# Altium schematic sheet schematic.SchDoc: Display & buttons board
size A2; Revision: 1; SheetNumber: 6; SheetTotal: 29
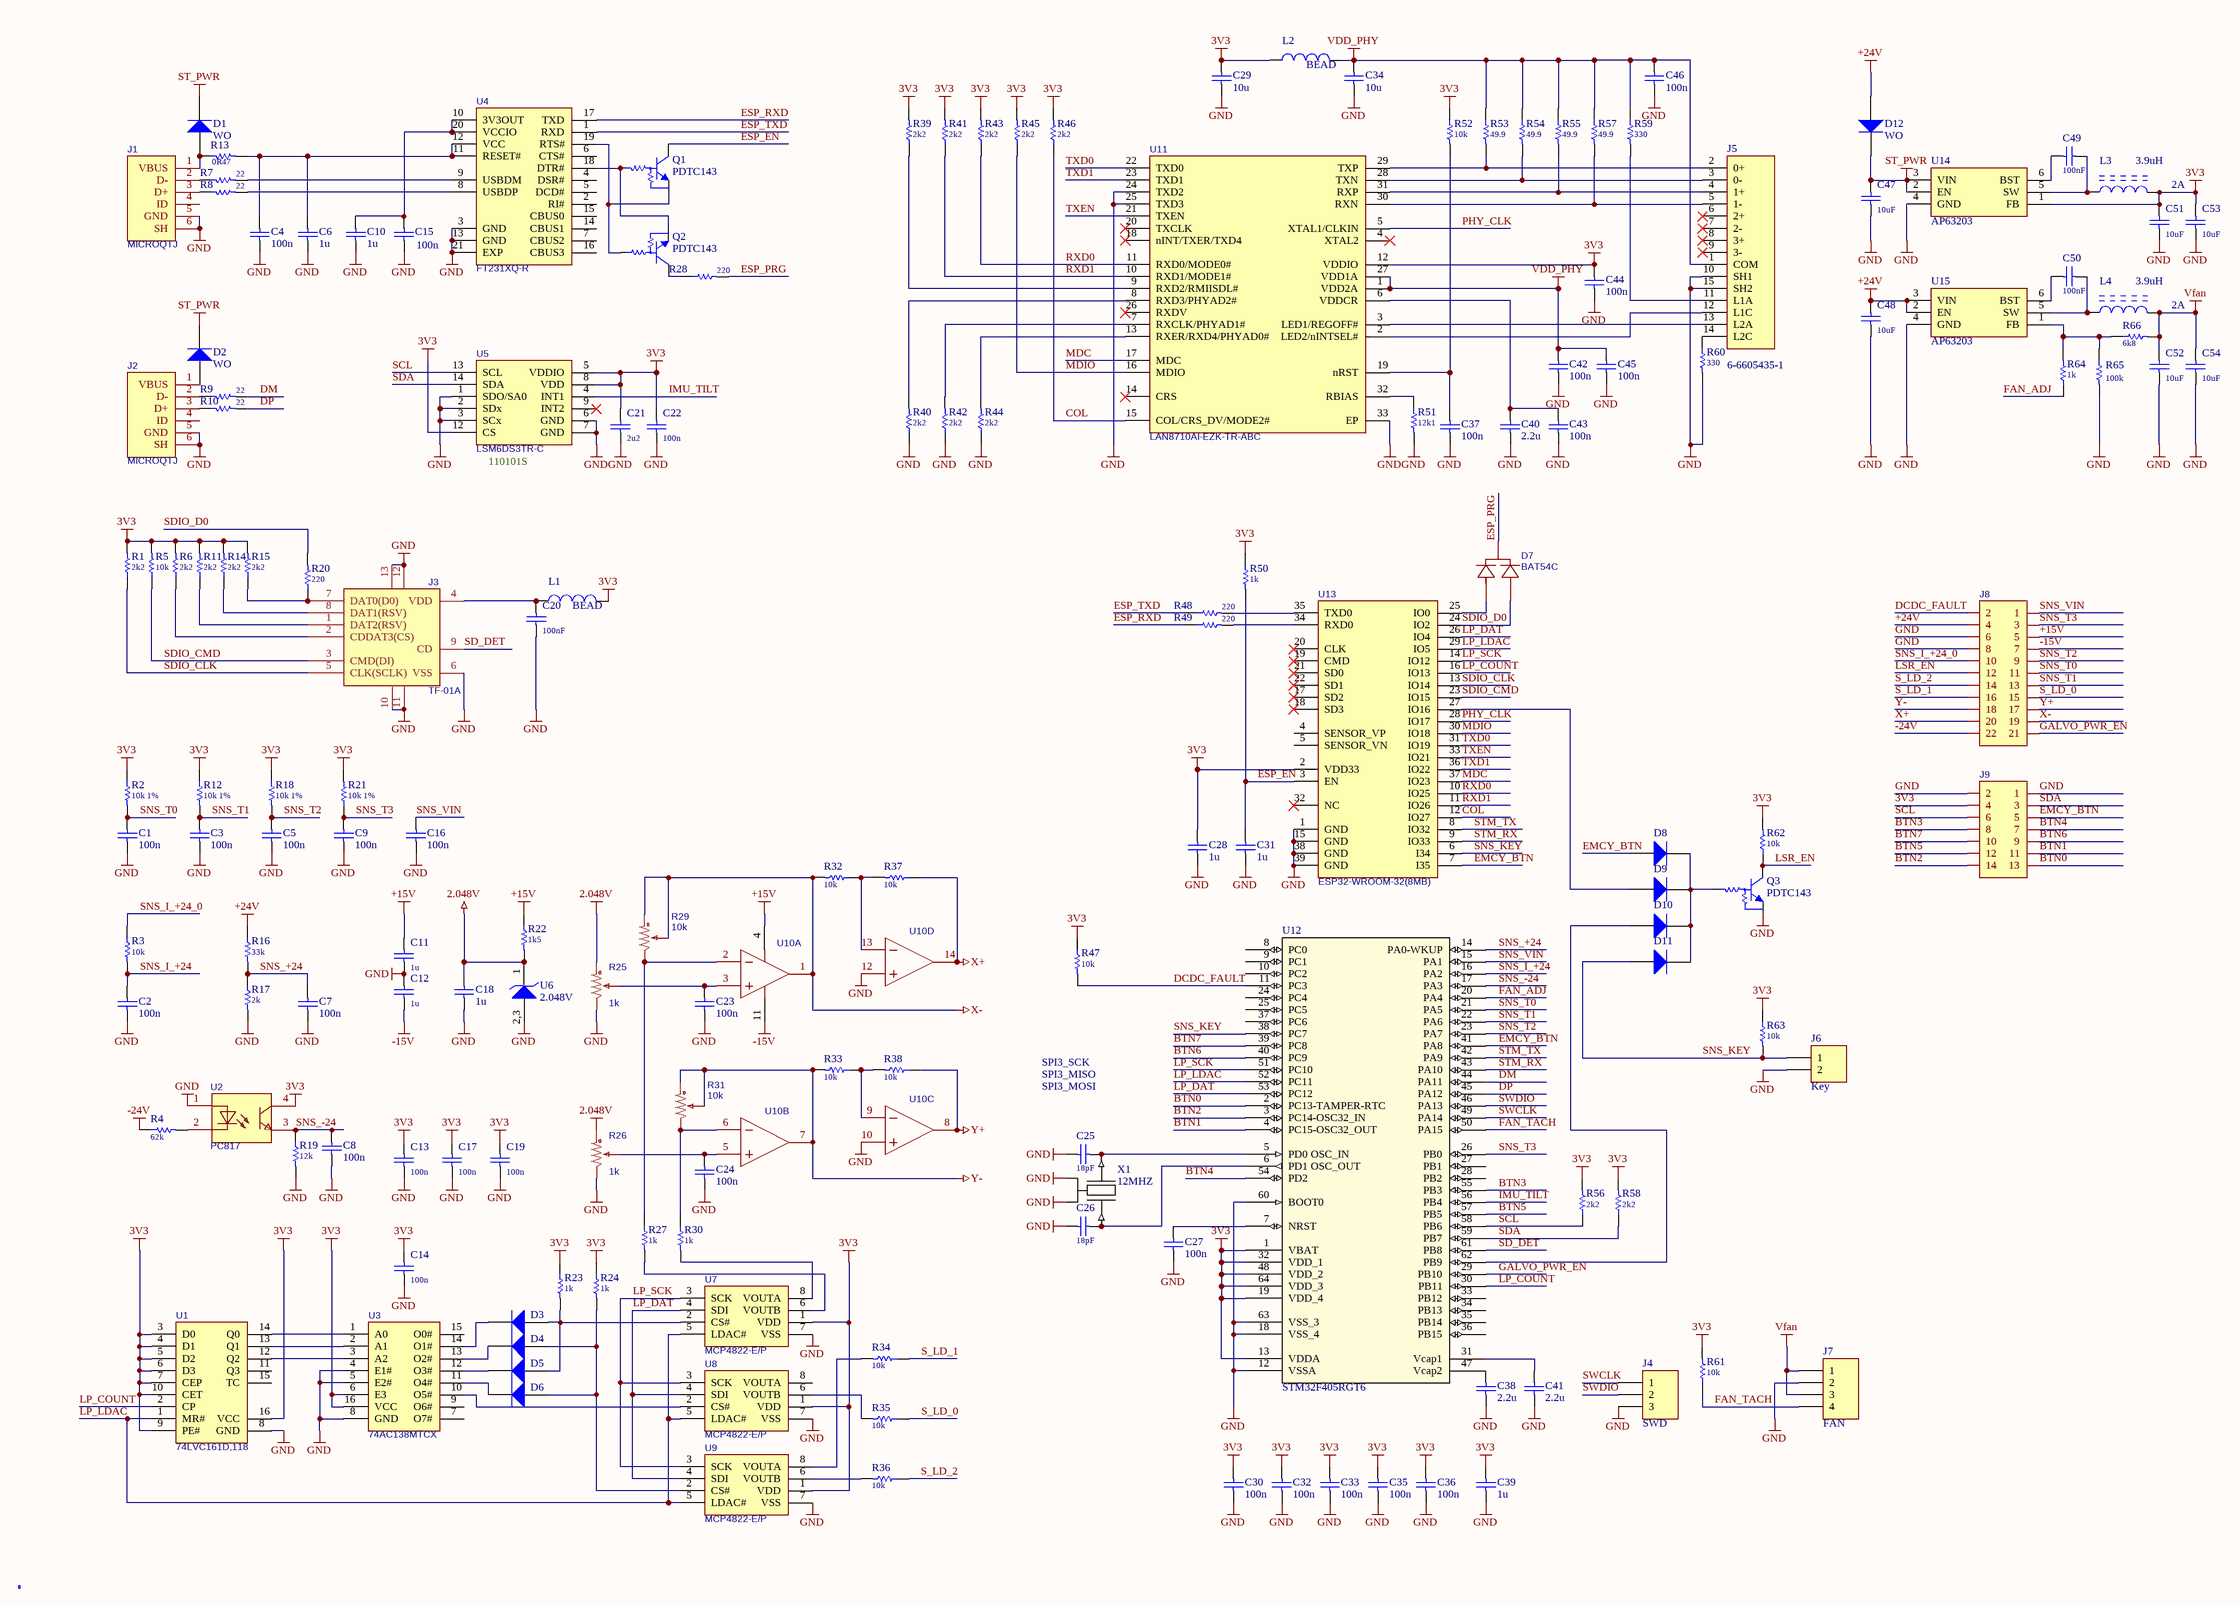
[diagram p0: schematic.SchDoc]

## Parts
C1  100n  [C0402]
C2  100n  [C0402]
C3  100n  [C0402]
C4  100n  [C0402]
C5  100n  [C0402]
C6  1u  [C0603]
C7  100n  [C0402]
C8  100n  [C0402]
C9  100n  [C0402]
C10  1u  [C0603]
C11  1u  [C0805]
C12  1u  [C0805]
C13  100n  [C0603]
C14  100n  [C0603]
C15  100n  [C0402]
C16  100n  [C0402]
C17  100n  [C0603]
C18  1u  [C0805]
C19  100n  [C0603]
C20  100nF  [C0402]
C21  2u2  [C0603]
C22  100n  [C0603]
C23  100n  [C0402]
C24  100n  [C0402]
C25  18pF  [C0402]
C26  18pF  [C0402]
C27  100n  [C0402]
C28  1u  [C0603]
C29  10u  [C0603]
C30  100n  [C0402]
C31  1u  [C0603]
C32  100n  [C0402]
C33  100n  [C0402]
C34  10u  [C0603]
C35  100n  [C0402]
C36  100n  [C0402]
C37  100n  [C0402]
C38  2.2u  [C0603]
C39  1u  [C0603]
C40  2.2u  [C0603]
C41  2.2u  [C0603]
C42  100n  [C0402]
C43  100n  [C0402]
C44  100n  [C0402]
C45  100n  [C0402]
C46  100n  [C0402]
C47  10uF  [C1206]
C48  10uF  [C1206]
C49  100nF  [C0402]
C50  100nF  [C0402]
C51  10uF  [C1206]
C52  10uF  [C1206]
C53  10uF  [C1206]
C54  10uF  [C1206]
D1  WO  [SMA]
D2  WO  [SMA]
D3  (no value)  [SOD-323]
D4  (no value)  [SOD-323]
D5  (no value)  [SOD-323]
D6  (no value)  [SOD-323]
D7  BAT54C  [SOT-23]
D8  (no value)  [SOD-323]
D9  (no value)  [SOD-323]
D10  (no value)  [SOD-323]
D11  (no value)  [SOD-323]
D12  WO  [SMA]
J1  MICROQTJ  [CONN-USB-MICRO_#1]
J2  MICROQTJ  [CONN-USB-MICRO_#1]
J3  TF-01A  [TF-SMD_TF-01A]
J4  SWD  [HDR-1x3-P1.25]  (no BOM)
J5  6-6605435-1  [6-6605435-1]
J6  Key  [HDR-1X2-P2.00]  (no BOM)
J7  FAN  [HDR-2X2-P2.00]  (no BOM)
J8  (no value)  [CONN-SMD_HDR_2X11]
J9  (no value)  [CONN-SMD_HDR_2X7]
L1  BEAD  [L0603]
L2  BEAD  [L0603]
L3  3.9uH  [IND_5020_L5.0-W5.0]
L4  3.9uH  [IND_5020_L5.0-W5.0]
LOGO?  LOGO  [LOGO]  (value not drawn)  (no BOM)
Q1  PDTC143  [SOT-23]
Q2  PDTC143  [SOT-23]
Q3  PDTC143  [SOT-23]
R1  2k2  [R0603]
R2  10k 1%  [R0402]
R3  10k  [R0603]
R4  62k  [R0603]
R5  10k  [R0603]
R6  2k2  [R0603]
R7  22  [R0603]
R8  22  [R0603]
R9  22  [R0603]
R10  22  [R0603]
R11  2k2  [R0603]
R12  10k 1%  [R0402]
R13  0R47  [R0603]
R14  2k2  [R0603]
R15  2k2  [R0603]
R16  33k  [R0603]
R17  2k  [R0603]
R18  10k 1%  [R0402]
R19  12k  [R0603]
R20  220  [R0603]
R21  10k 1%  [R0402]
R22  1k5  [R1206]
R23  1k  [R0402]
R24  1k  [R0402]
R25  1k  [RES-ADJ-TH_3P-L10.0-W10.0-P2.50-L]
R26  1k  [RES-ADJ-TH_3P-L10.0-W10.0-P2.50-L]
R27  1k  [R0603]
R28  220  [R0603]
R29  10k  [RES-ADJ-TH_3P-L10.0-W10.0-P2.50-L]
R30  1k  [R0603]
R31  10k  [RES-ADJ-TH_3P-L10.0-W10.0-P2.50-L]
R32  10k  [R0603]
R33  10k  [R0603]
R34  10k  [R0603]
R35  10k  [R0603]
R36  10k  [R0603]
R37  10k  [R0603]
R38  10k  [R0603]
R39  2k2  [R0603]
R40  2k2  [R0603]
R41  2k2  [R0603]
R42  2k2  [R0603]
R43  2k2  [R0603]
R44  2k2  [R0603]
R45  2k2  [R0603]
R46  2k2  [R0603]
R47  10k  [R0402]
R48  220  [R0402]
R49  220  [R0402]
R50  1k  [R0603]
R51  12k1  [R0603]
R52  10k  [R0603]
R53  49.9  [R0603]
R54  49.9  [R0603]
R55  49.9  [R0603]
R56  2k2  [R0402]
R57  49.9  [R0603]
R58  2k2  [R0402]
R59  330  [R0603]
R60  330  [R0603]
R61  10k  [R0603]
R62  10k  [R0603]
R63  10k  [R0603]
R64  1k  [R0603]
R65  100k  [R0603]
R66  6k8  [R0603]
U1  74LVC161D,118  [SOIC-16]
U2  PC817  [SMD-4]
U3  74AC138MTCX  [TSSOP-16]
U4  FT231XQ-R  [QFN-20_L4.0-W4.0-P0.50-BL-EP2.2]
U5  LSM6DS3TR-C  [LGA-14_L3.0-W2.5-P0.50-TL]
U6  2.048V  [SOT-23]
U7  MCP4822-E/P  [DIP-8]
U8  MCP4822-E/P  [DIP-8]
U9  MCP4822-E/P  [DIP-8]
U10  TL084  [SOIC-14]  (value not drawn)  (parts A,B,C,D of 4)
U11  LAN8710AI-EZK-TR-ABC  [QFN-32_L5.0-W5.0-P0.50-BL-EP3.3]
U12  STM32F405RGT6  [LQFP-64]
U13  ESP32-WROOM-32(8MB)  [WIFIM-SMD_39P-L25.5-W18.0-P1.27]
U14  AP63203  [SOT-23-6]
U15  AP63203  [SOT-23-6]
X1  12MHZ  [CRYSTAL_2.5x2.0mm]

## Nets
2.048V: C18.2 R22.2 R25.1 R26.1 U6.1(+)
3V3: C13.2 C14.2 C17.2 C19.2 C21.1 C22.1 C28.2 C29.2 C30.2 C32.2 C33.2 C35.2 C36.2 C39.2 C44.2 C51.2 C53.2 J9.4 L1.1 L2.2 L3.2 R1.2 R2.1 R5.2 R6.2 R11.2 R12.1 R14.2 R15.2 R18.1 R21.2 R23.1 R24.1 R39.2 R41.2 R43.2 R45.2 R46.2 R47.1 R50.1 R52.1 R56.2 R58.2 R61.2 R62.2 R63.1 U1.3(D0) U1.4(D1) U1.5(D2) U1.6(D3) U1.7(CEP) U1.9(PE#) U1.10(CET) U1.16(VCC) U2.4 U3.6(E3) U3.16(VCC) U5.5(VDDIO) U5.8(VDD) U5.12(CS) U7.1(VDD) U8.1(VDD) U9.1(VDD) U11.12(VDDIO) U12.1(VBAT) U12.13(VDDA) U12.19(VDD_4) U12.32(VDD_1) U12.48(VDD_2) U12.64(VDD_3) U13.2(VDD33) U14.1(FB)
+15V: C11.2 J8.5 R22.1 U10.4(V+)
+24V: C48.2 D12.1(A) J8.4 R16.1 U15.2(EN) U15.3(VIN)
-15V: C12.1 J8.7 U10.11(V-)
-24V: J8.22 R4.1
GND: C1.1 C2.1 C3.1 C4.1 C5.1 C6.1 C7.1 C8.1 C9.1 C10.1 C11.1 C12.2 C13.1 C14.1 C15.1 C16.1 C17.1 C18.1 C19.1 C20.1 C21.2 C22.2 C23.1 C24.1 C25.1 C26.1 C27.1 C28.1 C29.1 C30.1 C31.1 C32.1 C33.1 C34.1 C35.1 C36.1 C37.1 C38.1 C39.1 C40.1 C41.1 C42.1 C43.1 C44.1 C45.1 C46.1 C47.1 C48.1 C51.1 C52.1 C53.1 C54.1 J1.5(GND) J1.6(SH) J2.5(GND) J2.6(SH) J3.6(VSS) J3.10(GND) J3.11(GND) J3.12(GND) J3.13(GND) J4.3 J5.10(SH1) J5.15(SH2) J6.2 J7.2 J8.6 J8.8 J9.1 J9.2 Q3.2(E) R17.2 R19.2 R25.3 R26.3 R40.1 R42.1 R44.1 R51.2 R60.2 R65.2 U1.8(GND) U2.1 U3.4(E1#) U3.5(E2#) U3.8(GND) U4.3(GND) U4.13(GND) U4.21(EXP) U5.1(SDO/SA0) U5.2(SDx) U5.3(SCx) U5.6(GND) U5.7(GND) U6.2,3(-) U7.7(VSS) U8.7(VSS) U9.7(VSS) U10.10(INC+) U10.12(IND+) U11.24(TXD2) U11.25(TXD3) U11.33(EP) U12.12(VSSA) U12.18(VSS_4) U12.60(BOOT0) U12.63(VSS_3) U13.1(GND) U13.15(GND) U13.38(GND) U13.39(GND) U14.4(GND) U15.4(GND) X1.2(GND) X1.4(GND)
ST_PWR: C47.2 D1.2(K) D2.2(K) D12.2(K) U14.2(EN) U14.3(VIN)
VDD_PHY: C34.2 C42.2 C45.2 C46.2 J5.1(COM) L2.1 R53.1 R54.1 R55.1 R57.1 R59.1 U11.1(VDD2A) U11.27(VDD1A)
Vfan: C52.2 C54.2 J7.1 J7.3 L4.2 R66.2
X+: J8.20 R37.1 U10.14(OUTD)
X-: J8.19 R29.1 R29.2 R32.2 U10.1(OUTA)
Y+: J8.17 R38.1 U10.8(OUTC)
Y-: J8.18 R31.1 R31.2 R33.2 U10.7(OUTB)
BTN0: J9.13 U12.2(PC13-TAMPER-RTC)
BTN1: J9.11 U12.4(PC15-OSC32_OUT)
BTN2: J9.14 U12.3(PC14-OSC32_IN)
BTN3: J9.8 U12.55(PB3)
BTN4: J9.7 U12.54(PD2)
BTN5: J9.12 U12.57(PB5)
BTN6: J9.9 U12.40(PC9)
BTN7: J9.10 U12.39(PC8)
COL: R46.1 U11.15(COL/CRS_DV/MODE2#) U13.12(IO27)
DCDC_FAULT: J8.2 R47.2 U12.11(PC3)
DM: R9.2 U12.44(PA11)
DP: R10.2 U12.45(PA12)
EMCY_BTN: D8.1(A) J9.5 U12.41(PA8) U13.7(I35)
ESP_EN: C31.2 Q1.3(C) R50.2 U13.3(EN)
ESP_PRG: D7.3 R28.2
ESP_RXD: R49.1 U4.17(TXD)
ESP_TXD: R48.1 U4.1(RXD)
FAN_ADJ: R64.1 U12.20(PA4)
FAN_TACH: J7.4 R61.1 U12.50(PA15)
GALVO_PWR_EN: J8.21 U12.29(PB10)
IMU_TILT: U5.4(INT1) U12.56(PB4)
LP_COUNT: U1.2(CP) U12.30(PB11) U13.16(IO13)
LP_DAT: U7.4(SDI) U8.4(SDI) U9.4(SDI) U12.53(PC12) U13.26(IO4)
LP_LDAC: U1.1(MR#) U7.5(LDAC#) U8.5(LDAC#) U9.5(LDAC#) U12.52(PC11) U13.29(IO5)
LP_SCK: U7.3(SCK) U8.3(SCK) U9.3(SCK) U12.51(PC10) U13.14(IO12)
LSR_EN: J8.12 Q3.3(C) R62.1
MDC: U11.17(MDC) U13.37(IO23)
MDIO: R45.1 U11.16(MDIO) U13.30(IO18)
PHY_CLK: U11.5(XTAL1/CLKIN) U13.28(IO17)
RXD0: R43.1 U11.11(RXD0/MODE0#) U13.10(IO25)
RXD1: R41.1 U11.10(RXD1/MODE1#) U13.11(IO26)
S_LD_0: J8.15 R35.1
S_LD_1: J8.16 R34.1
S_LD_2: J8.14 R36.1
SCL: J9.6 R56.1 U5.13(SCL) U12.58(PB6)
SD_DET: J3.9(CD) U12.61(PB8)
SDA: J9.3 R58.1 U5.14(SDA) U12.59(PB7)
SDIO_CLK: J3.5(CLK(SCLK)) R1.1 U13.13(IO14)
SDIO_CMD: J3.3(CMD(DI)) R5.1 U13.23(IO15)
SDIO_D0: D7.2 R20.2 U13.24(IO2)
SNS_+24: C7.2 R16.2 R17.1 U12.14(PA0-WKUP)
SNS_-24: C8.2 R19.1 U2.3 U12.17(PA3)
SNS_I_+24: C2.2 R3.2 U12.16(PA2)
SNS_I_+24_0: J8.10 R3.1
SNS_KEY: D11.1(A) J6.1 R63.2 U12.38(PC7) U13.6(I34)
SNS_T0: C1.2 J8.11 R2.2 U12.21(PA5)
SNS_T1: C3.2 J8.13 R12.2 U12.22(PA6)
SNS_T2: C5.2 J8.9 R18.2 U12.23(PA7)
SNS_T3: C9.2 J8.3 R21.1 U12.26(PB0)
SNS_VIN: C16.2 J8.1 U12.15(PA1)
STM_RX: U12.43(PA10) U13.9(IO33)
STM_TX: U12.42(PA9) U13.8(IO32)
SWCLK: J4.1 U12.49(PA14)
SWDIO: J4.2 U12.46(PA13)
TXD0: U11.22(TXD0) U13.31(IO19)
TXD1: U11.23(TXD1) U13.36(IO22)
TXEN: U11.21(TXEN) U13.33(IO21)
NetC4_2: C4.2 C6.2 R13.2 U4.11(RESET#) U4.12(VCC)
NetC10_2: C10.2 C15.2 U4.10(3V3OUT) U4.20(VCCIO)
NetC20_2: C20.2 J3.4(VDD) L1.2
NetC23_2: C23.2 R25.2 U10.3(INA+)
NetC24_2: C24.2 R26.2 U10.5(INB+)
NetC25_2: C25.2 U12.5(PD0_OSC_IN) X1.1(X1)
NetC26_2: C26.2 U12.6(PD1_OSC_OUT) X1.3(X2)
NetC27_2: C27.2 U12.7(NRST)
NetC37_2: C37.2 R52.2 U11.19(nRST)
NetC38_2: C38.2 U12.47(Vcap2)
NetC40_2: C40.2 C43.2 U11.6(VDDCR)
NetC41_2: C41.2 U12.31(Vcap1)
NetC49_1: C49.1 L3.1 U14.5(SW)
NetC49_2: C49.2 U14.6(BST)
NetC50_1: C50.1 L4.1 U15.5(SW)
NetC50_2: C50.2 U15.6(BST)
NetD1_1: D1.1(A) J1.1(VBUS) R13.1
NetD2_1: D2.1(A) J2.1(VBUS)
NetD3_1: D3.1(A) D5.1(A) R23.2 U7.2(CS#)
NetD3_2: D3.2(K) U3.14(O1#)
NetD4_1: D4.1(A) D6.1(A) R24.2 U9.2(CS#)
NetD4_2: D4.2(K) U3.13(O2#)
NetD5_2: D5.2(K) U3.12(O3#)
NetD6_2: D6.2(K) U3.11(O4#)
NetD7_1: D7.1 U13.25(IO0)
NetD8_2: D8.2(K) D9.2(K) D10.2(K) D11.2(K) Q3.1(B)
NetD9_1: D9.1(A) U13.27(IO16)
NetD10_1: D10.1(A) U12.62(PB9)
NetJ1_2: J1.2(D-) R7.1
NetJ1_3: J1.3(D+) R8.1
NetJ2_2: J2.2(D-) R9.1
NetJ2_3: J2.3(D+) R10.1
NetJ3_1: J3.1(DAT2(RSV)) R11.1
NetJ3_2: J3.2(CDDAT3(CS)) R6.1
NetJ3_7: J3.7(DAT0(D0)) R15.1 R20.1
NetJ3_8: J3.8(DAT1(RSV)) R14.1
NetJ5_2: J5.2(0+) R53.2 U11.29(TXP)
NetJ5_3: J5.3(0-) R54.2 U11.28(TXN)
NetJ5_4: J5.4(1+) R55.2 U11.31(RXP)
NetJ5_5: J5.5(1-) R57.2 U11.30(RXN)
NetJ5_11: J5.11(L1A) R59.2
NetJ5_12: J5.12(L1C) U11.2(LED2/nINTSEL#)
NetJ5_13: J5.13(L2A) U11.3(LED1/REGOFF#)
NetJ5_14: J5.14(L2C) R60.1
NetQ1_1: Q1.1(B) Q2.2(E) U4.18(DTR#)
NetQ1_2: Q1.2(E) Q2.1(B) U4.19(RTS#)
NetQ2_3: Q2.3(C) R28.1
NetR4_2: R4.2 U2.2
NetR7_2: R7.2 U4.9(USBDM)
NetR8_2: R8.2 U4.8(USBDP)
NetR27_1: R27.1 R29.3 U10.2(INA-)
NetR27_2: R27.2 U7.6(VOUTB)
NetR30_1: R30.1 R31.3 U10.6(INB-)
NetR30_2: R30.2 U7.8(VOUTA)
NetR32_1: R32.1 R37.2 U10.13(IND-)
NetR33_1: R33.1 R38.2 U10.9(INC-)
NetR34_2: R34.2 U9.8(VOUTA)
NetR35_2: R35.2 U8.6(VOUTB)
NetR36_2: R36.2 U9.6(VOUTB)
NetR39_1: R39.1 U11.9(RXD2/RMIISDL#)
NetR40_2: R40.2 U11.8(RXD3/PHYAD2#)
NetR42_2: R42.2 U11.7(RXCLK/PHYAD1#)
NetR44_2: R44.2 U11.13(RXER/RXD4/PHYAD0#)
NetR48_2: R48.2 U13.35(TXD0)
NetR49_2: R49.2 U13.34(RXD0)
NetR51_1: R51.1 U11.32(RBIAS)
NetR64_2: R64.2 R65.1 R66.1 U15.1(FB)
NetU1_12: U1.12(Q2) U3.3(A2)
NetU1_13: U1.13(Q1) U3.2(A1)
NetU1_14: U1.14(Q0) U3.1(A0)
NetU3_10: U3.10(O5#) U8.2(CS#)

Not connected (* = marked no-connect by the designer): J1 4(ID); J2 4(ID); J5 6(2+)* 7(2-)* 8(3+)* 9(3-)*; U1 11(Q3) 15(TC); U3 7(O7#) 9(O6#) 15(O0#); U4 2(RI#) 4(DSR#) 5(DCD#) 6(CTS#) 7(CBUS2) 14(CBUS1) 15(CBUS0) 16(CBUS3); U5 9(INT2)*; U8 8(VOUTA); U11 4(XTAL2)* 14(CRS)* 18(nINT/TXER/TXD4)* 20(TXCLK)* 26(RXDV)*; U12 8(PC0) 9(PC1) 10(PC2) 24(PC4) 25(PC5) 27(PB1) 28(PB2) 33(PB12) 34(PB13) 35(PB14) 36(PB15) 37(PC6); U13 4(SENSOR_VP) 5(SENSOR_VN) 17(SD2)* 18(SD3)* 19(CMD)* 20(CLK)* 21(SD0)* 22(SD1)* 32(NC)*

## Notes on the sheet
- 2A
- (near U5) 110101S
- SPI3_SCK
- SPI3_MISO
- SPI3_MOSI

## Library data of the parts
C1-C10 C15 C16 C18 C23 C24 C27 C28 C30-C33 C35-C46 = Cap
C11 C12 = CAP: 1u 0805
C13 C14 C17 C19-C22 = CAP
C25 C26 = CAP: 18pF 50V 0402; P/N: GRM1555C1H180JA01D; LCSC part number: C33149
C29 C34 = Cap: 10u 0603
C47 C48 C51-C54 = CAP: 10uf 50V 1206; P/N: CL31B106KBHNNNE; LCSC part number: C89632
C49 C50 = CAP: P/N: CC0402KRX7R9BB104; LCSC part number: C131394
D1-D6 D8-D12 = US1M-13-F
D7 = BAT54C_C727125: LCSC part number: C727125; P/N: BAT54C
J4 = Header 3
J6 J7 = Header 2
J8 = HDR 2X11
J9 = HDR 2X7
L1 L2 = BLM18AG601SN1D
L3 L4 = SRN3015-100M: 3.9uH 2A; P/N: SWPA5020S3R9NT; LCSC part number: C115009
Q1-Q3 = MMBT2222ALT1G: PDTC143XT,215; LCSC part number: C183011; P/N: PDTC143XT,215
R1 R6 R11 R14 R15 R39-R46 = RES_0402_1K5-1%
R2 R12 R18 R21 = RES: 10k 1% 0402; P/N: RC0402FR-0710KL; LCSC part number: C60490
R3 R4 R7-R10 R13 R16 R17 R19 R22-R24 R27 R30 R32-R38 R47 R52 R56 R58-R63 = RES
R5 = RES_0402_1K5-1%: 10k 0603
R20 R28 R48 R49 = RES: 220 0603
R25 R26 R29 R31 = 10kΩ
R50 = RES: 1k 0603
R51 = RES: 12k1 0603
R53-R55 R57 = RES: 49.9 0603
R64 = RES: 1k 0603; P/N: RC0603FR-071KL; LCSC part number: C22548
R65 = R0402_Dup1: 100k 0603
R66 = RES: 6k8 0603; P/N: RC0603FR-076K8L; LCSC part number: C114632
U2 = PC817C_C3025164
U6 = NCP51460SN33T1G: LM4040C20IDBZR
U12 = STM32F405RGT6: MCU STM32F405RGT6; P/N: STM32F405RGT6
U14 U15 = AP63203: P/N: AP63203WU-7; LCSC part number: C780769
X1 = CRYSTAL 12MHZ 3.20mm x 2.50mm: CRYSTAL 12MHZ 10PF SMD; P/N: TXM12M0004252FBCEO00T; LCSC part number: C284155
U5 = LSM6DS3TR-C: LCSC part number: C967633; P/N: LSM6DS3TR-C